# EAGLE design esp12_RGBWW (EAGLE 7.7.0)
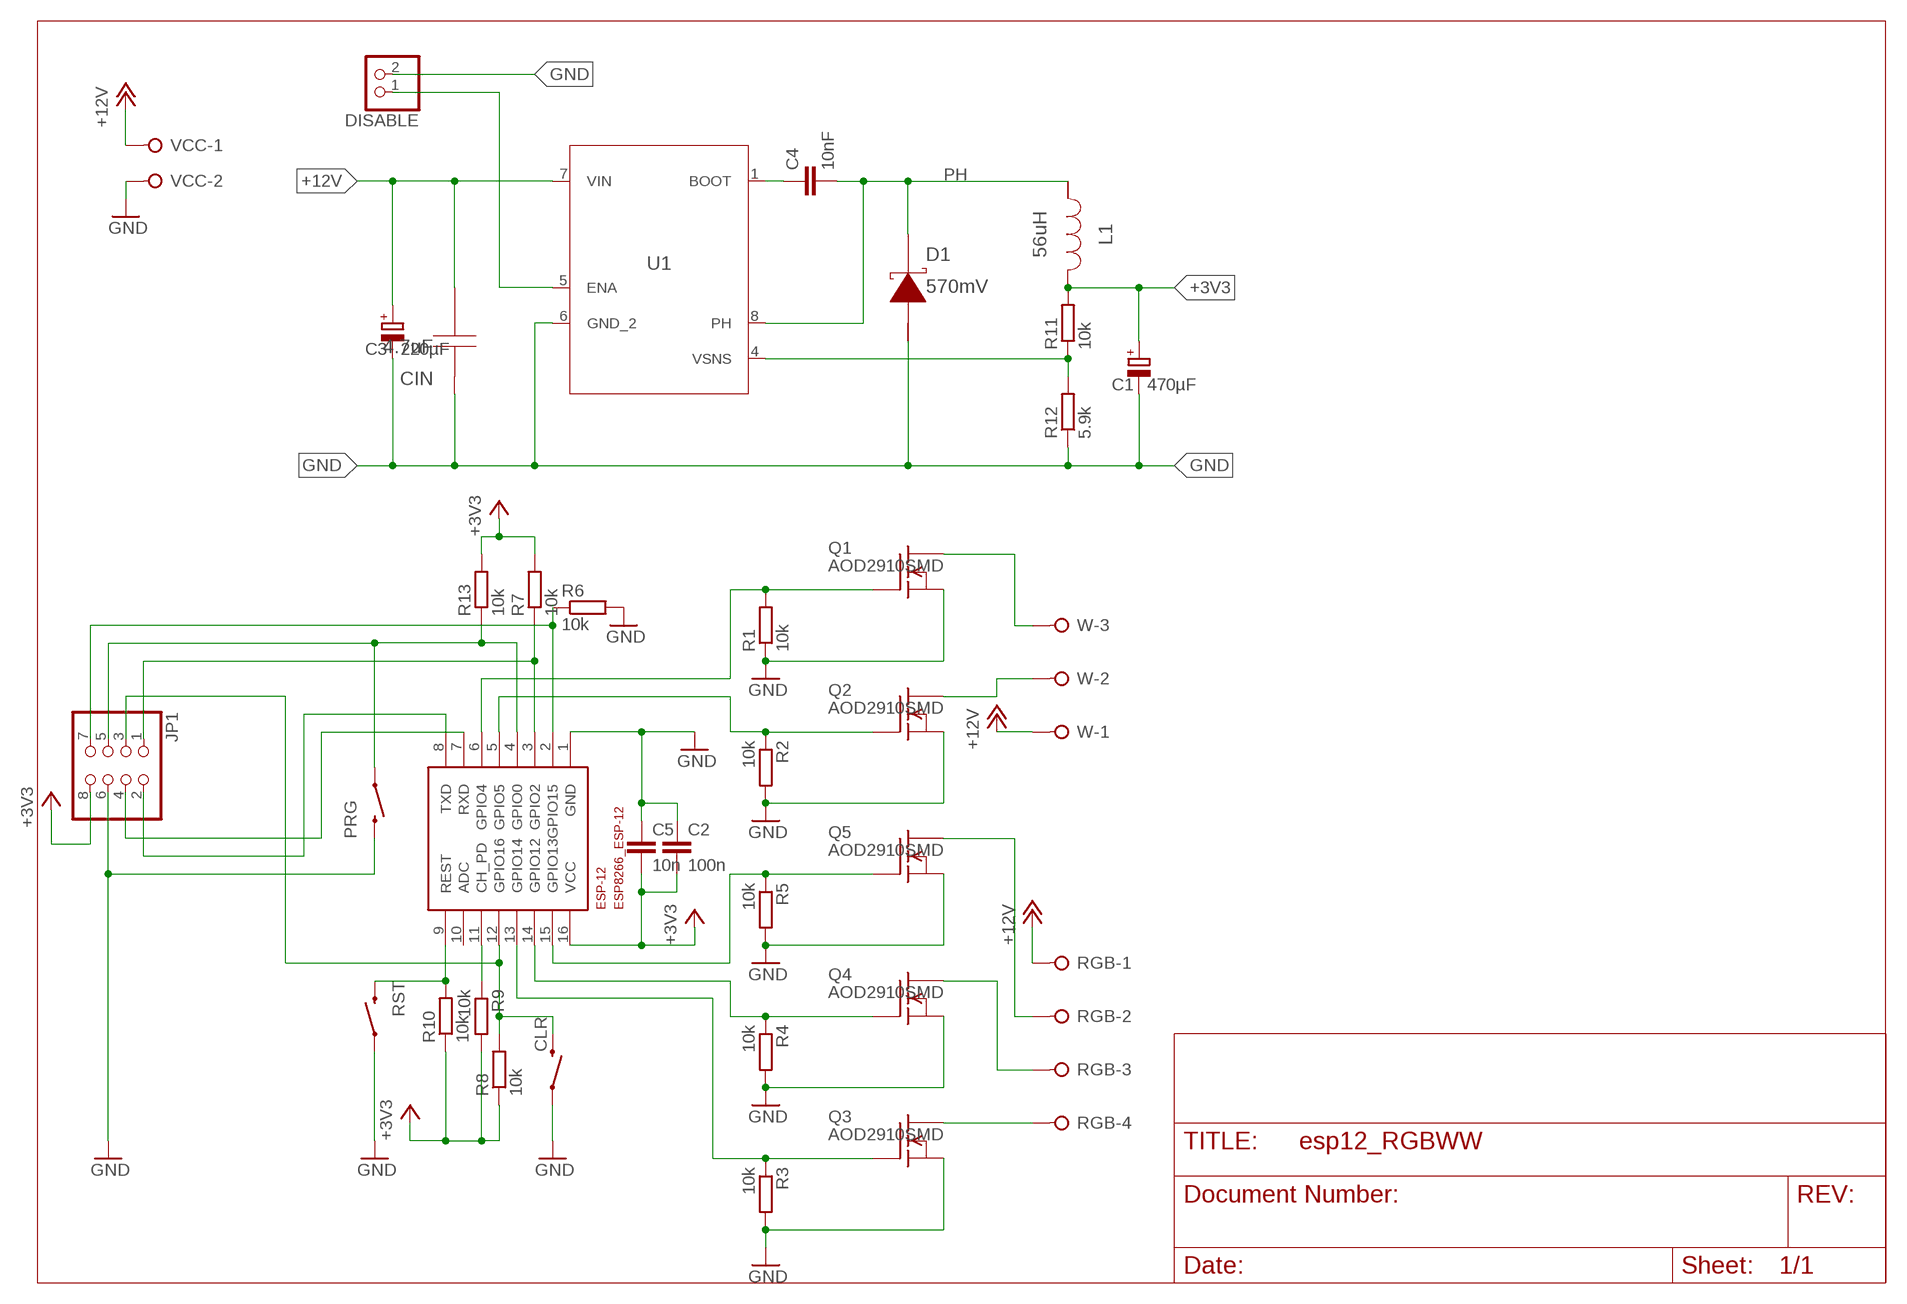
[diagram p0: schematic, sheet 1]

## Parts
C1  470µF  CPOL-EUE2.5-7  [E2,5-7]
C2  100n  C-EUC0805  [C0805]
C3  220µF  CPOL-EUE2.5-7  [E2,5-7]
C4  10nF  C-EUC0805  [C0805]
C5  10n  C-EUC0805  [C0805]
CIN  4.7uF  GRM31CR71H475KA12L  [1206]
CLR  SWITCH-MOMENTARY-2SMD-1101NE  [TACTILE-SWITCH-1101NE]
D1  570mV  B160-13-F  [SMA]
DISABLE  PINHD-1X2  [1X02]
ESP-12  ESP8266_ESP-12  [ESP8266-ESP12]
JP1  PINHD-2X4  [2X04]
L1  56uH  NPI75C560KTRF  [IND_NPI75C]
PRG  SWITCH-MOMENTARY-2SMD-1101NE  [TACTILE-SWITCH-1101NE]
Q1  AOD2910SMD  [DPAK-3]
Q2  AOD2910SMD  [DPAK-3]
Q3  AOD2910SMD  [DPAK-3]
Q4  AOD2910SMD  [DPAK-3]
Q5  AOD2910SMD  [DPAK-3]
R1  10k  R-EU_R0805  [R0805]
R2  10k  R-EU_R0805  [R0805]
R3  10k  R-EU_R0805  [R0805]
R4  10k  R-EU_R0805  [R0805]
R5  10k  R-EU_R0805  [R0805]
R6  10k  R-EU_R0805  [R0805]
R7  10k  R-EU_R0805  [R0805]
R8  10k  R-EU_R0805  [R0805]
R9  10k  R-EU_R0805  [R0805]
R10  10k  R-EU_R0805  [R0805]
R11  10k  R-EU_R0805  [R0805]
R12  5.9k  R-EU_R0805  [R0805]
R13  10k  R-EU_R0805  [R0805]
RGB  W237-04P  [W237-4P]
RST  SWITCH-MOMENTARY-2SMD-1101NE  [TACTILE-SWITCH-1101NE]
U1  TPS5410DR  [M08A]
VCC  W237-02P  [W237-132]
W  W237-03P  [W237-133]

## Nets
+3V3: C1.+ C2.2 C5.2 ESP-12.16(VCC) JP1.8 L1.1 R7.2 R8.1 R9.2 R10.1 R11.2 R13.2
+12V: C3.+ CIN.2 RGB.1 U1.7(VIN) VCC.1 W.1
B: Q3.4(D) RGB.4
BOOT: C4.1 U1.1(BOOT)
CH_PD [Signal]: ESP-12.11(CH_PD) R9.1
CLR_S: CLR.2 ESP-12.12(GPIO16) JP1.3 R8.2
CW: Q2.4(D) W.2
ENA: DISABLE.1 U1.5(ENA)
G: Q4.4(D) RGB.3
G2: ESP-12.3(GPIO2) JP1.1 R7.1
G15: ESP-12.2(GPIO15) JP1.7 R6.1
GND: C1.- C2.1 C3.- C5.1 CIN.1 CLR.1 D1.2(A) DISABLE.2 ESP-12.1(GND) JP1.6 PRG.2 Q1.3(S) Q2.3(S) Q3.3(S) Q4.3(S) Q5.3(S) R1.1 R2.2 R3.2 R4.2 R5.2 R6.2 R12.1 RST.1 U1.6(GND_2) VCC.2
PH: C4.2 D1.1(K) L1.2 U1.8(PH)
PRG_S [Signal]: ESP-12.4(GPIO0) JP1.5 PRG.1 R13.1
R: Q5.4(D) RGB.2
RGB-B: ESP-12.13(GPIO14) Q3.1(G) R3.1
RGB-CW: ESP-12.5(GPIO5) Q2.1(G) R2.1
RGB-G: ESP-12.14(GPIO12) Q4.1(G) R4.1
RGB-R: ESP-12.15(GPIO13) Q5.1(G) R5.1
RGB-WW [Signal]: ESP-12.6(GPIO4) Q1.1(G) R1.2
RST_S [Signal]: ESP-12.9(REST) R10.2 RST.2
RXD: ESP-12.7(RXD) JP1.4
SENS: R11.1 R12.2 U1.4(VSNS)
TXD: ESP-12.8(TXD) JP1.2
WW: Q1.4(D) W.3
Unconnected: ESP-12.10(ADC)

## Library data of the parts
C1 C3 = resistor:CPOL-EU: POLARIZED CAPACITOR, European symbol
C2 C5 = rcl:C-EU: CAPACITOR, European symbol
C4 = resistor:C-EU: CAPACITOR, European symbol
CIN = AcceleratedDesigns_Lib:GRM31CR71H475KA12L; CAP: 4.7E6; ESR: 0.0; IRMS: 0.0; MANUFACTURER_NAME: MuRata; MANUFACTURER_PART_NUMBER: GRM31CR71H475KA12L; VDC: 50.0; VENDOR: MuRata
CLR PRG RST = SparkFun-Electromechanical:SWITCH-MOMENTARY-2: Various NO switches- pushbuttons, reed, etc; PROD_ID: SWCH-00815
D1 = TI_Accelerated_Design_neu:B160-13-F; DATASHEETURL: httpwww.diodes.comdatasheetsds13002.pdf; IO: 1.0; MANUFACTURER_NAME: Diodes Inc.; MANUFACTURER_PART_NUMBER: B16013F; VENDOR: Diodes Inc.; VFATIO: 0.7; VRRM: 60.0
DISABLE = pinhead:PINHD-1X2: PIN HEADER
ESP-12 = ESP8266-ESP12:ESP8266_ESP-12
JP1 = adafruit:PINHD-2X4: PIN HEADER
L1 = AcceleratedDesigns_Lib:NPI75C560KTRF; DCR: 0.24; IDC: 0.94; L: 5.6E5; MANUFACTURER_NAME: NIC Components; MANUFACTURER_PART_NUMBER: NPI75C560KTRF; VENDOR: NIC Components
Q1-Q5 = transistor-fet+irf7201:AOD2910: N-Channel Enhancement MOSFET 100V; 32A; 0,024Ohm
R1-R10 R13 = rcl:R-EU_: RESISTOR, European symbol
R11 R12 = resistor:R-EU_: RESISTOR, European symbol
RGB = con-wago-508:W237-04P: WAGO SREW CLAMP; OC_FARNELL: unknown; OC_NEWARK: unknown
U1 = AcceleratedDesigns_Lib:TPS5410DR; DATASHEETURL: httpwww.ti.comproducttps5410; FREQUENCY: 500000.0; IMAX: 1.0; MANUFACTURER_NAME: Texas Instruments; MANUFACTURER_PART_NUMBER: TPS5410DR; MKTG_PACKAGE: TPS5410; NSID: TPS5410D; PACKAGE: TPS5410; VENDOR: Texas Instruments
VCC = con-wago-508:W237-02P: WAGO SREW CLAMP; OC_FARNELL: unknown; OC_NEWARK: unknown
W = con-wago-508:W237-03P: WAGO SREW CLAMP; OC_FARNELL: unknown; OC_NEWARK: unknown

## Net classes
5 Signal: width 0.381 mm

## Board
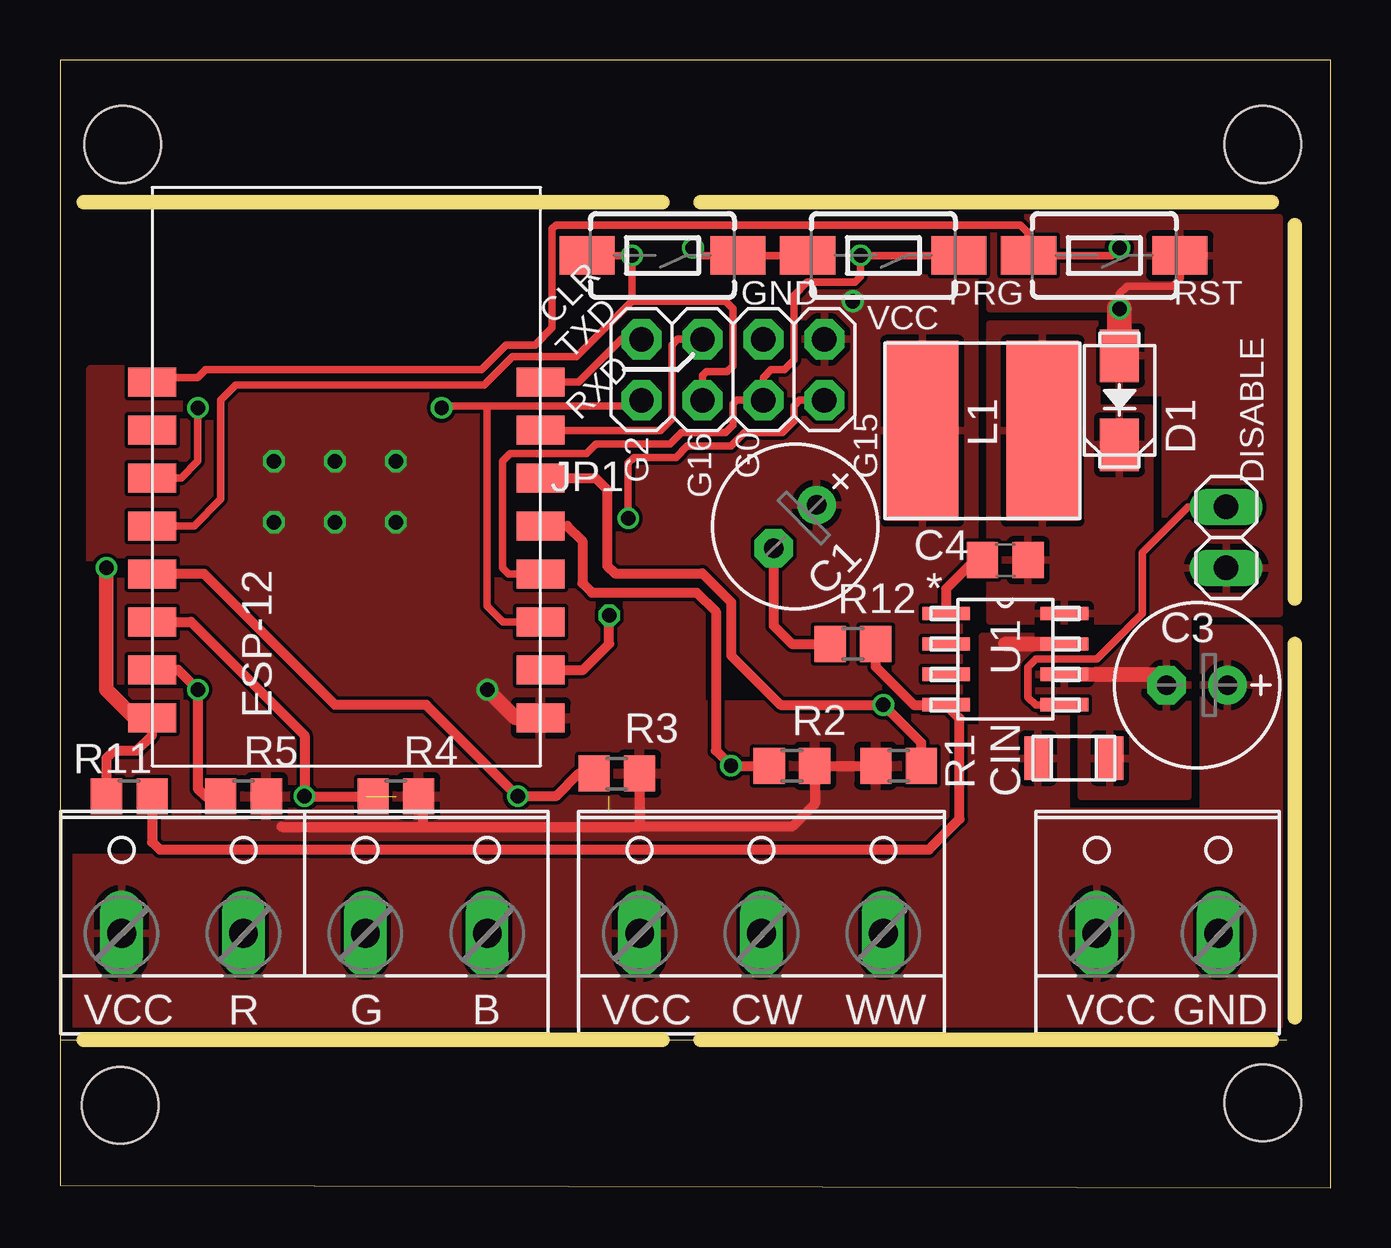
[diagram p1: board, top side]
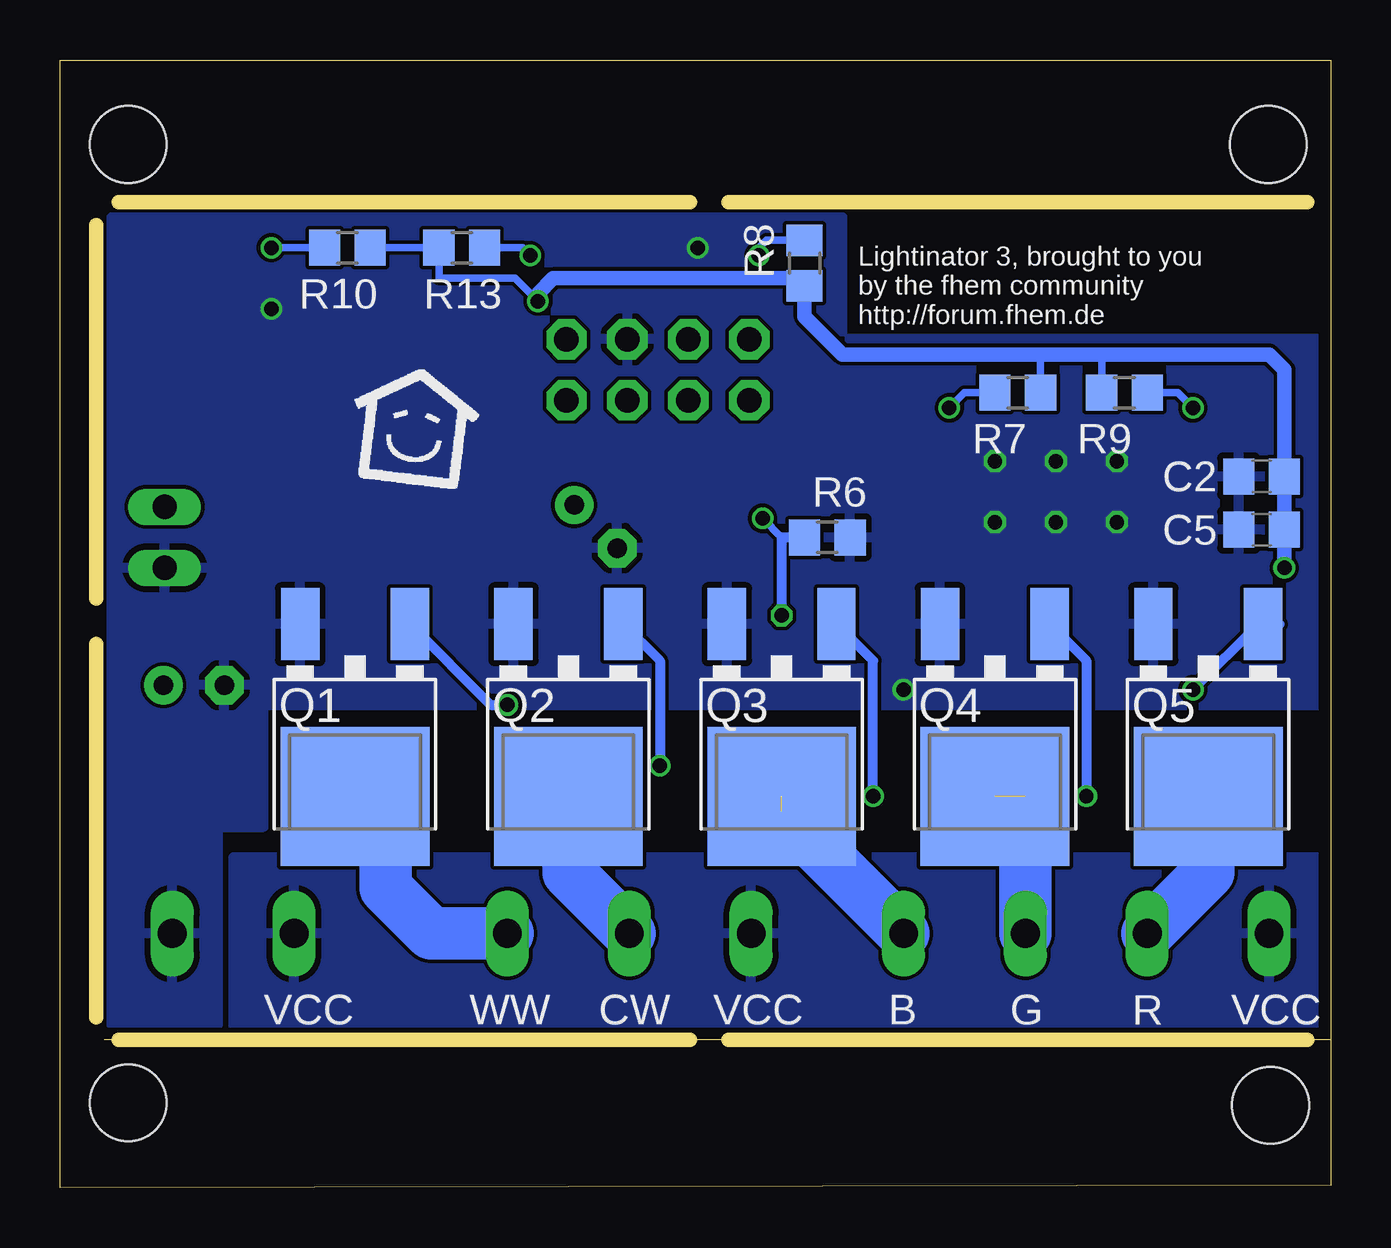
[diagram p2: board, bottom side, seen from below]

Size 52.97 x 47.01 mm. Coordinates in mm from the lower left corner, seen from the top.
Outline: 0.03,6.16 51.13,6.16
Outline: 52.97,0 52.97,47.01 0,47.01 0,0.1 52.97,0
Copper layers (1*16): Top 0.035mm / dielectric 1.6mm / Bottom 0.035mm
Design rules "Elecrow_2-layer_PCB_eagle_rule": minimum track width 6mil, minimum drill 12mil, track to track 6mil, track to pad 8mil, pad to pad 12mil, via to via 12mil, smd to smd 0mil, copper to edge 20mil, drill to drill 10mil, minimum pad ring 6mil, minimum via ring 6mil, stop-mask expansion 0mil, vias tented up to drill 100mil, thermal gap 10mil
Holes 3.2 mm at 50.13,3.54 50.13,43.49 2.61,43.49 2.51,3.44
Milling: 6 lines

### Footprints (pad centres in the part's own frame; a part is rotated, then mirrored left to right if it is on the bottom)
E2,5-7 = drill 0.813 pad 1.6: + -1.27,0 | drill 0.813 pad 1.6 octagon: - 1.27,0
C0805 = smd 1.3 x 1.5: 1 -0.95,0; 2 0.95,0
1206 = smd 1.118 x 1.803: 1 -1.499,0; 2 1.499,0
TACTILE-SWITCH-1101NE = smd 2.3 x 1.6: 1 -3.15,0; 2 3.15,0
SMA = smd 2.184 x 1.626: 1 -1.854,0; 2 1.854,0
1X02 = drill 1.016 long: 1 -1.27,0; 2 1.27,0
ESP8266-ESP12 = smd 2 x 1.2: 1 16.2,2; 2 16.2,4; 3 16.2,6; 4 16.2,8; 5 16.2,10; 6 16.2,12; 7 16.2,14; 8 16.2,16; 9 0,16; 10 0,14; 11 0,12; 12 0,10; 13 0,8; 14 0,6; 15 0,4; 16 0,2
2X04 = drill 1.016 pad 1.676 octagon: 1 -3.81,-1.27; 2 -3.81,1.27; 3 -1.27,-1.27; 4 -1.27,1.27; 5 1.27,-1.27; 6 1.27,1.27; 7 3.81,-1.27; 8 3.81,1.27
IND_NPI75C = smd 2.997 x 7.493: 1 -2.502,0; 2 2.502,0
DPAK-3 = smd 1.6 x 3: 1 -2.286,-7.18; 3 2.286,-7.18 | smd 6.2 x 5.8: 4 0,0
R0805 = smd 1.3 x 1.5: 1 -0.95,0; 2 0.95,0
W237-4P = drill 1.194 long: 1 -7.62,-0.635; 2 -2.54,-0.635; 3 2.54,-0.635; 4 7.62,-0.635
M08A = smd 1.981 x 0.559: 1 -2.464,1.905; 2 -2.464,0.635; 3 -2.464,-0.635; 4 -2.464,-1.905; 5 2.464,-1.905; 6 2.464,-0.635; 7 2.464,0.635; 8 2.464,1.905
W237-132 = drill 1.194 long: 1 -2.54,-0.635; 2 2.54,-0.635
W237-133 = drill 1.194 long: 1 -5.08,-0.635; 2 0,-0.635; 3 5.08,-0.635

### Placement (x,y rotation side)
C1  30.64,27.56 225 top
C2  2.89,29.65 0 bottom
C3  47.39,20.95 180 top
C4  39.4,26.16 0 top
C5  2.89,27.43 0 bottom
CIN  42.26,17.91 180 top
CLR  25.11,38.86 180 top
D1  44.16,32.83 90 top
DISABLE  48.61,27.11 270 top
ESP-12  3.84,17.59 0 top
JP1  28.05,34.1 0 top
L1  38.45,31.56 0 top
PRG  34.32,38.86 180 top
Q1  40.67,16.32 180 bottom
Q2  31.78,16.32 180 bottom
Q3  22.89,16.32 180 bottom
Q4  14,16.32 180 bottom
Q5  5.11,16.32 180 bottom
R1  34.95,17.59 0 top
R2  30.51,17.59 0 top
R3  23.21,17.27 0 top
R4  14,16.32 0 top
R5  7.65,16.32 0 top
R6  20.98,27.11 0 bottom
R7  13.05,33.15 0 bottom
R8  21.94,38.54 90 bottom
R9  8.6,33.15 180 bottom
R10  40.99,39.18 180 bottom
R11  2.89,16.32 180 top
R12  33.05,22.67 0 top
R13  36.22,39.18 180 bottom
RGB  10.19,11.24 0 top
RST  43.53,38.86 180 top
U1  39.4,22.03 0 top
U$1  [LOGO]  40.67,29.02 0 bottom
VCC  45.75,11.24 0 top
W  29.24,11.24 0 top

### Tracks (layer width: path | path; a pad name or v marks a point on that pad's centre or on a via)
+3V3  (via drill 0.6, 0.6 pad 0.61)
  Top 0.406: 3.11,19.59 ESP-12.16 3.84,18.86 3.21,18.22 2.25,18.22 1.94,17.91 R11.2
  Top 0.61: 3.11,19.59 1.94,20.76 v1.94,25.84
  Bottom 0.305: R8.1 21.62,37.91 | R9.2 9.55,34.73 9.56,34.73 | R7.2 12.1,34.73 | R10.1 R13.2 37.18,37.91 34,37.91 v33.05,36.95
  Bottom 0.61: 21.62,37.91 32.41,37.91 33.05,37.27 v33.05,36.95 | v1.94,25.84 C5.2 C2.2 1.94,34.1 2.57,34.73 9.56,34.73 12.1,34.73 20.35,34.73 21.94,36.32 R8.1
  pour Top: 37.49,18.54 37.49,25.21 38.13,25.21 38.13,37.91 20.35,37.91 20.35,18.54
+12V
  Top 0.61: U1.7 39.4,22.67
  pour Bottom: 0.03,6.16 0.03,13.78 45.75,13.78 45.75,6.16
  pour Top: 38.45,22.98 40.67,22.98 40.67,20.13 41.94,20.13 41.94,15.68 47.65,15.68 47.65,23.3 50.83,23.3 50.83,6.79 0.03,6.79 0.03,13.78 36.54,13.78 36.54,19.18 38.45,19.18
B  (1 unrouted)
  Bottom 2.184: 22.89,15.68 RGB.4
BOOT
  Top 0.406: U1.1 36.94,24.96 38.13,26.16 C4.1
CH_PD  (via drill 0.6)
  Top 0.305: ESP-12.11 5.04,29.59 5.75,30.29 v5.75,32.51
  Bottom 0.305: R9.1 6.38,33.15 v5.75,32.51
CLR_S  (via drill 0.6)
  Top 0.305: 3.68,27.75 ESP-12.12 5.58,27.59 6.7,28.7 6.7,32.83 7.33,33.46 17.68,33.46 18.87,34.65 21.54,34.65 23.84,36.95 | 21.94,38.84 CLR.2 v23.84,38.86 23.84,36.95 | 23.84,36.95 27.73,36.95 28.05,36.64 28.05,34.26 27.81,34.02 26.94,34.02 26.78,33.86 JP1.3
  Bottom 0.305: R8.2 23.53,39.49 23.84,39.18 v23.84,38.86
CW
  Bottom 2.184: Q2.4 31.78,13.14 W.2
ENA
  Top 0.305: U1.5 40.67,20.13 40.35,20.44 40.35,21.71 40.67,22.03 43.21,22.03 45.11,23.94 45.11,26.48 47.02,28.38 DISABLE.1
G  (1 unrouted)
  Bottom 2.184: 12.73,16.32 RGB.3
G2  (via drill 0.6)
  Top 0.305: 17.81,32.59 17.81,24.26 18.48,23.59 ESP-12.3 | 17.81,32.59 15.98,32.59 v15.91,32.51 | 17.81,32.59 24,32.59 JP1.1
  Bottom 0.305: R7.1 15.27,33.15 v15.91,32.51
G15  (via drill 0.6)
  Top 0.305: v23.68,27.91 23.68,30.21 23.92,30.45 25.67,30.45 26.14,30.92 27.97,30.92 28.53,31.48 30.11,31.48 30.59,31.95 30.59,32.59 30.83,32.83 JP1.7
  Top 0.406: ESP-12.2 21.81,21.59 22.89,22.67 v22.89,23.86
  Bottom 0.305: 22.89,27.11 v23.68,27.91
  Bottom 0.406: R6.1 22.89,27.11 v22.89,23.86
GND  (via drill 0.6, 0.6 pad 0.41)
  Top 0.305: 44.8,34.73 44.16,34.1 | RST.1 46.7,39.15 46.7,37.91 46.38,37.59 44.48,37.59 44.16,37.27 v44.16,36.64 | v26.38,39.18 26.7,38.86 CLR.1 PRG.2
  Top 0.406: 24.16,17.59 R3.2 24.16,15.05 | R1.1 R2.2 31.46,16 30.51,15.05 24.16,15.05 | C1.- 29.74,23.43 30.51,22.67 R12.1 | 9.24,15.05 15.11,15.05 | 15.11,15.05 24.16,15.05 | R4.2 15.11,16.32 15.11,15.05
  Top 0.61: v17.81,20.76 18.98,19.59 ESP-12.1 | U1.6 45.67,21.4 C3.-
  Top 1.016: 44.16,34.1 D1.2 v44.16,36.64
  other vias: 8.92,30.29 11.46,30.29 14,30.29 14,27.75 11.46,27.75 8.92,27.75
  pour Bottom: 0.03,35.37 20.35,35.37 20.35,40.45 50.83,40.45 50.83,6.79 46.38,6.79 46.38,15.05 44.48,15.05 44.48,20.13 0.03,20.13
  pour Top: 40.67,22.67 44.48,22.67 44.48,27.11 46.07,27.11 46.07,33.15 43.84,33.15 43.84,36.64 38.77,36.64 38.77,40.45 50.83,40.45 50.83,23.94 47.02,23.94 47.02,16.32 42.57,16.32 42.57,19.81 40.67,19.81
  pour Top: 1.3,34.1 19.08,34.1 19.08,29.02 26.7,29.02 26.7,20.13 36.86,20.13 36.86,13.78 1.3,13.78
PH
  pour Top: 38.77,23.62 38.77,36 43.21,36 43.21,32.51 45.43,32.51 45.43,23.62
PRG_S  (via drill 0.6)
  Top 0.305: ESP-12.4 18.7,25.59 18.45,25.84 18.45,30.29 18.76,30.61 21.94,30.61 22.33,31 25.43,31 25.91,31.48 27.73,31.48 28.05,31.8 28.05,32.67 28.21,32.83 JP1.5 29.32,33.78 29.64,34.1 30.19,34.1 30.59,34.49 30.59,37.19 31.14,37.75 33.13,37.75 33.37,37.99 v33.37,38.86 PRG.1
  Top 0.406: 20.06,25.6 ESP-12.4
  Bottom 0.305: 34.95,38.86 R13.1 33.68,39.18 v33.37,38.86
R
  Bottom 2.184: Q5.4 5.11,13.14 RGB.2
RGB-B  (via drill 0.6)
  Top 0.406: ESP-12.13 6,25.59 11.46,20.13 15.27,20.13 v19.08,16.32 20.67,16.32 21.62,17.27 R3.1
  Bottom 0.406: v19.08,16.32 19.08,21.97 Q3.1
RGB-CW  (via drill 0.6)
  Top 0.406: R2.1 v27.97,17.59 27.34,18.22 27.34,24.02 26.54,24.81 22.18,24.81 21.78,25.21 21.78,26.95 21.14,27.59 ESP-12.5
  Bottom 0.406: Q2.1 27.97,21.97 v27.97,17.59
RGB-G  (via drill 0.6 pad 0.41)
  Top 0.406: ESP-12.14 5.46,23.59 10.19,18.86 v10.19,16.32 R4.1
  Bottom 0.406: Q4.1 10.19,21.97 v10.19,16.32
RGB-R  (via drill 0.6)
  Top 0.305: ESP-12.15 4.92,21.59 | 6.06,16.32 R5.1
  Top 0.406: 4.92,21.59 v5.75,20.76 5.75,16.63 6.06,16.32
  Bottom 0.305: Q5.1 3.01,23.5
  Bottom 0.406: Q5.1 2.13,23.5 | 3.01,23.5 v5.75,20.76
RGB-WW  (via drill 0.6)
  Top 0.406: R1.2 35.9,18.54 v34.32,20.13 30.03,20.13 27.97,22.19 27.97,24.41 26.78,25.6 23.13,25.6 22.81,25.92 22.81,29.1 22.32,29.59 ESP-12.6
  Bottom 0.406: Q1.1 35.01,20.13 v34.32,20.13
RST_S  (via drill 0.6)
  Top 0.305: 3.96,33.46 ESP-12.9 4.03,33.78 5.75,33.78 6.06,34.1 17.57,34.1 18.6,35.13 19.79,35.13 20.51,35.84 20.51,39.97 20.67,40.13 40.03,40.13 40.35,39.81 40.35,38.88 RST.2 | 40.35,39.2 RST.2 | RST.2 43.84,38.86 v44.16,39.18
  Bottom 0.305: R10.2 v44.16,39.18
RXD
  Top 0.305: ESP-12.7 20.07,31.56 25.03,31.56 25.51,32.03 25.51,35.13 25.75,35.37 JP1.4
SENS
  Top 0.406: R11.1 3.84,14.42 4.16,14.1 36.22,14.1 37.49,15.36 37.49,19.57 U1.4 35.59,20.13 34,21.72 R12.2
TXD
  Top 0.305: ESP-12.8 21.62,33.59 23.4,35.37 JP1.2
WW
  Bottom 2.184: W.3 37.49,10.6 39.4,12.51 39.4,15.05 Q1.4

### Text on the board
tNames: GND | VCC | TXD | RXD | G2 | G16 | G0 | G15 | VCC | R | G | B | VCC | CW | WW | GND
bNames: Lightinator 3, brought to you / by the fhem community / http://forum.fhem.de | VCC | R | G | B | VCC | CW | WW | VCC